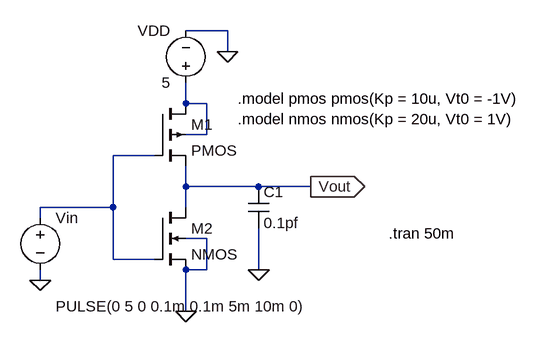
[diagram p0: schematic Exp 3 CMOS Inverter Transient Analysis.asc]
Exp 3 CMOS Inverter Transient Analysis.asc, the LTspice schematic file:
Version 4
SHEET 1 880 680
WIRE 288 -48 224 -48
WIRE 288 -16 288 -48
WIRE 224 64 224 32
WIRE 256 64 224 64
WIRE 256 112 256 64
WIRE 256 112 224 112
WIRE 176 144 112 144
WIRE 224 192 224 160
WIRE 336 192 224 192
WIRE 416 192 336 192
WIRE 112 224 112 144
WIRE 112 224 0 224
WIRE 224 224 224 192
WIRE 0 240 0 224
WIRE 256 272 224 272
WIRE 112 304 112 224
WIRE 176 304 112 304
WIRE 256 320 256 272
WIRE 256 320 224 320
WIRE 336 320 336 256
WIRE 0 336 0 320
WIRE 224 384 224 320
FLAG 224 384 0
FLAG 336 320 0
FLAG 288 -16 0
FLAG 416 192 Vout
IOPIN 416 192 Out
FLAG 0 336 0
SYMBOL pmos4 176 64 R0
SYMATTR InstName M1
SYMATTR Value2 l=5u w=20u
SYMBOL nmos4 176 224 R0
SYMATTR InstName M2
SYMATTR Value2 l=5u w=10u
SYMBOL cap 320 192 R0
SYMATTR InstName C1
SYMATTR Value 0.1pf
SYMBOL voltage 224 48 R180
WINDOW 0 24 96 Left 2
WINDOW 3 24 16 Left 2
WINDOW 123 0 0 Left 0
WINDOW 39 0 0 Left 0
SYMATTR InstName VDD
SYMATTR Value 5
SYMBOL voltage 0 224 R0
WINDOW 3 24 152 Left 2
WINDOW 123 24 124 Left 2
WINDOW 39 0 0 Left 0
SYMATTR Value PULSE(0 5 0 0.1m 0.1m 5m 10m 0)
SYMATTR InstName Vin
TEXT 304 56 Left 2 !.model pmos pmos(Kp = 10u, Vt0 = -1V)
TEXT 304 88 Left 2 !.model nmos nmos(Kp = 20u, Vt0 = 1V)
TEXT 536 264 Left 2 !.tran 50m

The netlist it stands for:
* Exp 3 CMOS Inverter Transient Analysis.asc
M1 N001 N002 Vout N001 PMOS l=5u w=20u
M2 Vout N002 0 0 NMOS l=5u w=10u
C1 Vout 0 0.1pf
VDD N001 0 5
Vin N002 0 PULSE(0 5 0 0.1m 0.1m 5m 10m 0)
.model NMOS NMOS
.model PMOS PMOS
.lib standard.mos
.model pmos pmos(Kp = 10u, Vt0 = -1V)
.model nmos nmos(Kp = 20u, Vt0 = 1V)
.tran 50m
.backanno
.end